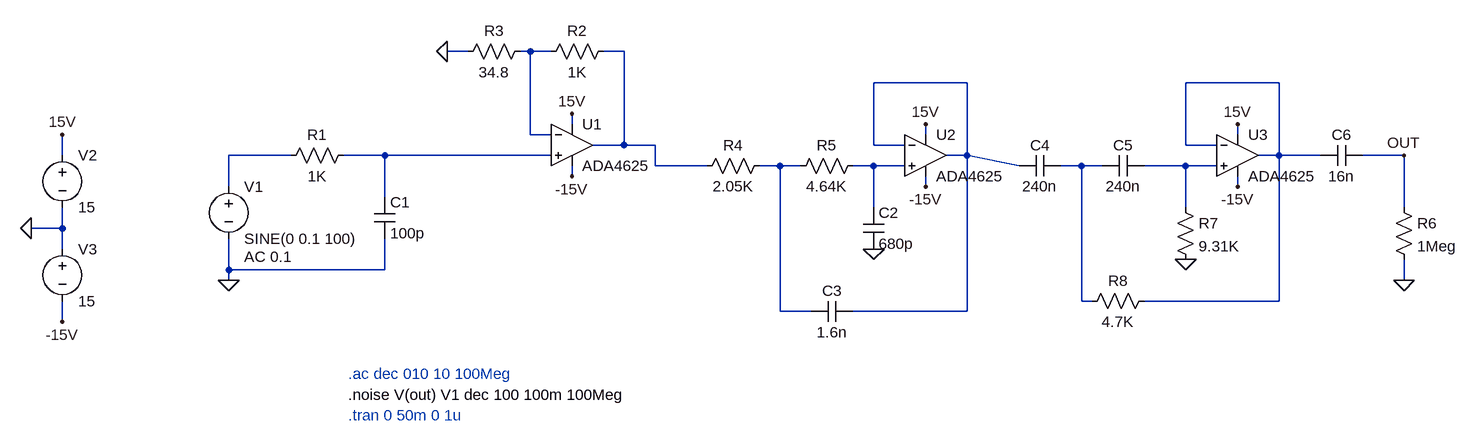
[diagram p0: schematic Draft13.asc]
Draft13.asc, the LTspice schematic file:
Version 4
SHEET 1 1912 680
WIRE 384 -160 352 -160
WIRE 480 -160 464 -160
WIRE 512 -160 480 -160
WIRE 624 -160 592 -160
WIRE 1152 -112 1008 -112
WIRE 1632 -112 1488 -112
WIRE 544 -48 544 -64
WIRE 480 -32 480 -160
WIRE 512 -32 480 -32
WIRE 1088 -32 1088 -48
WIRE 1568 -32 1568 -48
WIRE 624 -16 624 -160
WIRE 624 -16 576 -16
WIRE 672 -16 624 -16
WIRE 1008 -16 1008 -112
WIRE 1056 -16 1008 -16
WIRE 1488 -16 1488 -112
WIRE 1536 -16 1488 -16
WIRE -240 0 -240 -32
WIRE 112 0 16 0
WIRE 256 0 192 0
WIRE 512 0 256 0
WIRE 1152 0 1152 -112
WIRE 1152 0 1120 0
WIRE 1632 0 1632 -112
WIRE 1632 0 1600 0
WIRE 1696 0 1632 0
WIRE 1824 0 1760 0
WIRE 672 16 672 -16
WIRE 752 16 672 16
WIRE 864 16 832 16
WIRE 896 16 864 16
WIRE 1008 16 976 16
WIRE 1056 16 1008 16
WIRE 1232 16 1152 0
WIRE 1328 16 1296 16
WIRE 1360 16 1328 16
WIRE 1488 16 1424 16
WIRE 1536 16 1488 16
WIRE 544 32 544 16
WIRE 16 48 16 0
WIRE 1088 48 1088 32
WIRE 1568 48 1568 32
WIRE 256 64 256 0
WIRE 1008 80 1008 16
WIRE 1488 80 1488 16
WIRE 1824 80 1824 0
WIRE -240 112 -240 80
WIRE -240 112 -288 112
WIRE -240 144 -240 112
WIRE 16 176 16 128
WIRE 256 176 256 128
WIRE 256 176 16 176
WIRE 16 192 16 176
WIRE 1824 192 1824 160
WIRE 1328 224 1328 16
WIRE 1344 224 1328 224
WIRE 1632 224 1632 0
WIRE 1632 224 1424 224
WIRE 864 240 864 16
WIRE 912 240 864 240
WIRE 1152 240 1152 0
WIRE 1152 240 976 240
WIRE -240 256 -240 224
FLAG 16 192 0
FLAG 352 -160 0
FLAG -288 112 0
FLAG -240 256 -15V
FLAG -240 -32 15V
FLAG 544 -64 15V
FLAG 544 32 -15V
FLAG 1088 -48 15V
FLAG 1088 48 -15V
FLAG 1008 144 0
FLAG 1824 192 0
FLAG 1824 0 OUT
FLAG 1568 -48 15V
FLAG 1568 48 -15V
FLAG 1488 160 0
SYMBOL voltage 16 32 R0
WINDOW 123 24 124 Left 2
WINDOW 39 0 0 Left 0
SYMATTR InstName V1
SYMATTR Value SINE(0 0.1 100)
SYMATTR Value2 AC 0.1
SYMBOL cap 240 64 R0
SYMATTR InstName C1
SYMATTR Value 100p
SYMBOL res 208 -16 R90
WINDOW 0 0 56 VBottom 2
WINDOW 3 32 56 VTop 2
SYMATTR InstName R1
SYMATTR Value 1K
SYMBOL OpAmps\\ADA4625 544 -80 R0
SYMATTR InstName U1
SYMBOL res 608 -176 R90
WINDOW 0 0 56 VBottom 2
WINDOW 3 32 56 VTop 2
SYMATTR InstName R2
SYMATTR Value 1K
SYMBOL res 480 -176 R90
WINDOW 0 0 56 VBottom 2
WINDOW 3 32 56 VTop 2
SYMATTR InstName R3
SYMATTR Value 34.8
SYMBOL voltage -240 -16 R0
SYMATTR InstName V2
SYMATTR Value 15
SYMBOL voltage -240 128 R0
SYMATTR InstName V3
SYMATTR Value 15
SYMBOL OpAmps\\ADA4625 1088 -64 R0
SYMATTR InstName U2
SYMBOL res 848 0 R90
WINDOW 0 0 56 VBottom 2
WINDOW 3 32 56 VTop 2
SYMATTR InstName R4
SYMATTR Value 2.05K
SYMBOL res 992 0 R90
WINDOW 0 0 56 VBottom 2
WINDOW 3 32 56 VTop 2
SYMATTR InstName R5
SYMATTR Value 4.64K
SYMBOL cap 992 80 R0
SYMATTR InstName C2
SYMATTR Value 680p
SYMBOL cap 976 224 R90
WINDOW 0 0 32 VBottom 2
WINDOW 3 32 32 VTop 2
SYMATTR InstName C3
SYMATTR Value 1.6n
SYMBOL res 1808 64 R0
SYMATTR InstName R6
SYMATTR Value 1Meg
SYMBOL OpAmps\\ADA4625 1568 -64 R0
SYMATTR InstName U3
SYMBOL cap 1296 0 R90
WINDOW 0 0 32 VBottom 2
WINDOW 3 32 32 VTop 2
SYMATTR InstName C4
SYMATTR Value 240n
SYMBOL cap 1424 0 R90
WINDOW 0 0 32 VBottom 2
WINDOW 3 32 32 VTop 2
SYMATTR InstName C5
SYMATTR Value 240n
SYMBOL res 1472 64 R0
SYMATTR InstName R7
SYMATTR Value 9.31K
SYMBOL res 1440 208 R90
WINDOW 0 0 56 VBottom 2
WINDOW 3 32 56 VTop 2
SYMATTR InstName R8
SYMATTR Value 4.7K
SYMBOL cap 1760 -16 R90
WINDOW 0 0 32 VBottom 2
WINDOW 3 32 32 VTop 2
SYMATTR InstName C6
SYMATTR Value 16n
TEXT 200 368 Left 2 !.noise V(out) V1 dec 100 100m 100Meg
TEXT 200 400 Left 2 ;.tran 0 50m 0 1u
TEXT 200 336 Left 2 ;.ac dec 010 10 100Meg

The netlist it stands for:
* Draft13.asc
V1 N005 0 SINE(0 0.1 100) AC 0.1
C1 N006 0 100p
R1 N006 N005 1K
XU1 N006 N001 15V -15V N002 ADA4625  ; pins In+ In- V+ V- OUT
R2 N002 N001 1K
R3 N001 0 34.8
V2 15V 0 15
V3 0 -15V 15
XU2 N008 N003 15V -15V N003 ADA4625  ; pins In+ In- V+ V- OUT
R4 N007 N002 2.05K
R5 N008 N007 4.64K
C2 N008 0 680p
C3 N003 N007 1.6n
R6 OUT 0 1Meg
XU3 N010 N004 15V -15V N004 ADA4625  ; pins In+ In- V+ V- OUT
C4 N009 N003 240n
C5 N010 N009 240n
R7 N010 0 9.31K
R8 N004 N009 4.7K
C6 OUT N004 16n
.noise V(out) V1 dec 100 100m 100Meg
* .tran 0 50m 0 1u
* .ac dec 010 10 100Meg
.backanno
.end